# Altium schematic sheet M1.SchDoc
size A3; DocumentNumber: 2; SheetNumber: 2; SheetTotal: 8
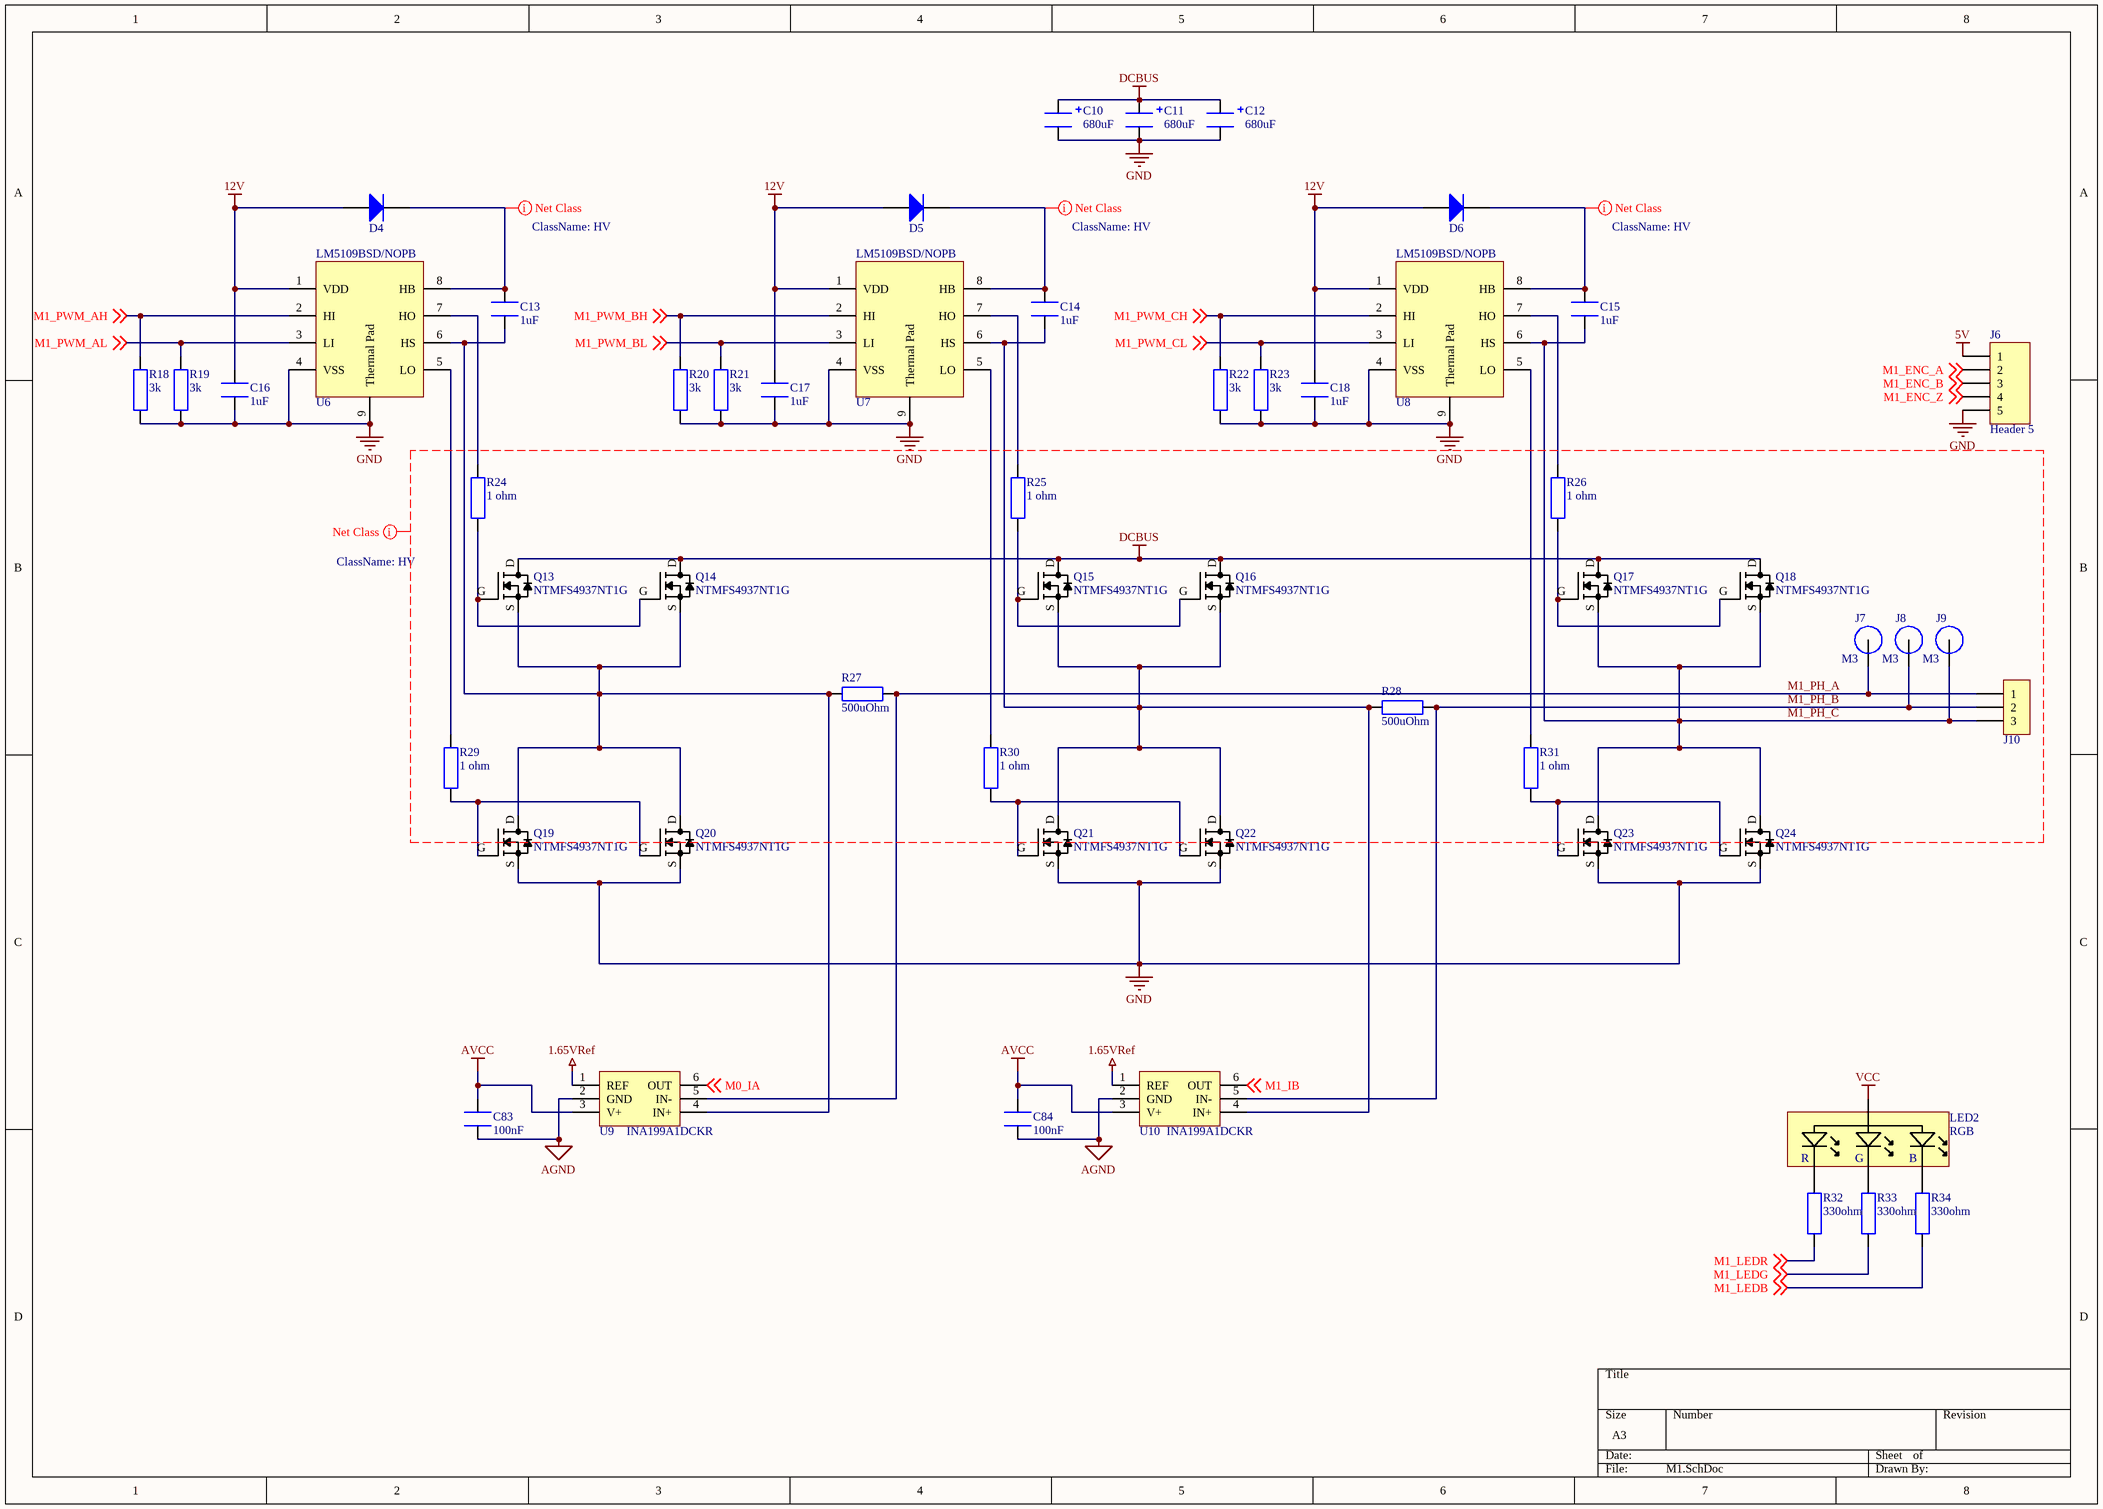
[diagram p0: M1.SchDoc]

## Parts
C10  value 680uF  [CAPE10.0MM_Rad_10x14mm]  (hidden comment: 35ZLH680MEFC10X23)
C11  value 680uF  [CAPE10.0MM_Rad_10x14mm]  (hidden comment: 35ZLH680MEFC10X23)
C12  value 680uF  [CAPE10.0MM_Rad_10x14mm]  (hidden comment: 35ZLH680MEFC10X23)
C13  value 1uF  [1608[0603]]  (hidden comment: MC0603X105K160)
C14  value 1uF  [1608[0603]]  (hidden comment: MC0603X105K160)
C15  value 1uF  [1608[0603]]  (hidden comment: MC0603X105K160)
C16  value 1uF  [1608[0603]]  (hidden comment: MC0603X105K160)
C17  value 1uF  [1608[0603]]  (hidden comment: MC0603X105K160)
C18  value 1uF  [1608[0603]]  (hidden comment: MC0603X105K160)
C83  value 100nF  [1608[0603]]  (hidden comment: MC0603B104K160CT)
C84  value 100nF  [1608[0603]]  (hidden comment: MC0603B104K160CT)
D4  RB521S30T1G  [SOD523F]  (value not drawn)
D5  RB521S30T1G  [SOD523F]  (value not drawn)
D6  RB521S30T1G  [SOD523F]  (value not drawn)
J6  Header 5  [HDR1X5]
J7  M3  [M3 Spade Hole]
J8  M3  [M3 Spade Hole]
J9  M3  [M3 Spade Hole]
J10  MC000051  [MC000051]  (value not drawn)
LED2  RGB  [ASMB-MTB1]
Q13  NTMFS4937NT1G  [SO8FL]
Q14  NTMFS4937NT1G  [SO8FL]
Q15  NTMFS4937NT1G  [SO8FL]
Q16  NTMFS4937NT1G  [SO8FL]
Q17  NTMFS4937NT1G  [SO8FL]
Q18  NTMFS4937NT1G  [SO8FL]
Q19  NTMFS4937NT1G  [SO8FL]
Q20  NTMFS4937NT1G  [SO8FL]
Q21  NTMFS4937NT1G  [SO8FL]
Q22  NTMFS4937NT1G  [SO8FL]
Q23  NTMFS4937NT1G  [SO8FL]
Q24  NTMFS4937NT1G  [SO8FL]
R18  value 3k  [RESC1608X55N]  (hidden comment: MCMR06X3001FTL)
R19  value 3k  [RESC1608X55N]  (hidden comment: MCMR06X3001FTL)
R20  value 3k  [RESC1608X55N]  (hidden comment: MCMR06X3001FTL)
R21  value 3k  [RESC1608X55N]  (hidden comment: MCMR06X3001FTL)
R22  value 3k  [RESC1608X55N]  (hidden comment: MCMR06X3001FTL)
R23  value 3k  [RESC1608X55N]  (hidden comment: MCMR06X3001FTL)
R24  value 1 ohm  [RESC1608X55N]  (hidden comment: MCWR06W1R00FTL)
R25  value 1 ohm  [RESC1608X55N]  (hidden comment: MCWR06W1R00FTL)
R26  value 1 ohm  [RESC1608X55N]  (hidden comment: MCWR06W1R00FTL)
R27  value 500uOhm  [RESC6332X70N]  (hidden comment: TLR3A20DR0005FTDG)
R28  value 500uOhm  [RESC6332X70N]  (hidden comment: TLR3A20DR0005FTDG)
R29  value 1 ohm  [RESC1608X55N]  (hidden comment: MCWR06W1R00FTL)
R30  value 1 ohm  [RESC1608X55N]  (hidden comment: MCWR06W1R00FTL)
R31  value 1 ohm  [RESC1608X55N]  (hidden comment: MCWR06W1R00FTL)
R32  value 330ohm  [RESC1608X55N]  (hidden comment: MCWR06X3300FTL)
R33  value 330ohm  [RESC1608X55N]  (hidden comment: MCWR06X3300FTL)
R34  value 330ohm  [RESC1608X55N]  (hidden comment: MCWR06X3300FTL)
U6  LM5109BSD/NOPB  [SON80P400X80_HS-9N]
U7  LM5109BSD/NOPB  [SON80P400X80_HS-9N]
U8  LM5109BSD/NOPB  [SON80P400X80_HS-9N]
U9  INA199A1DCKR  [TSOP65P210X110-6N]
U10  INA199A1DCKR  [TSOP65P210X110-6N]

## Nets
1.65VRef: U9.1(REF) U10.1(REF)
5V: J6.1
12V: C16.2 C17.2 C18.2 D4.A D5.A D6.A U6.1(VDD) U7.1(VDD) U8.1(VDD)
AGND: C83.1 C84.1 U9.2(GND) U10.2(GND)
AVCC: C83.2 C84.2 U9.3(V+) U10.3(V+)
DCBUS: C10.1 C11.1 C12.1 Q13.D Q14.D Q15.D Q16.D Q17.D Q18.D
GND: C10.2 C11.2 C12.2 C16.1 C17.1 C18.1 J6.5 Q19.S Q20.S Q21.S Q22.S Q23.S Q24.S R18.1 R19.1 R20.1 R21.1 R22.1 R23.1 U6.4(VSS) U6.9(Thermal_Pad) U7.4(VSS) U7.9(Thermal_Pad) U8.4(VSS) U8.9(Thermal_Pad)
VCC: LED2.4(A)
M0_IA: U9.6(OUT) ; off-sheet M0_IA
M1_ENC_A: J6.2 ; off-sheet M1_ENC_A
M1_ENC_B: J6.3 ; off-sheet M1_ENC_B
M1_ENC_Z: J6.4 ; off-sheet M1_ENC_Z
M1_IB: U10.6(OUT) ; off-sheet M1_IB
M1_LEDB: R34.2 ; off-sheet M1_LEDB
M1_LEDG: R33.2 ; off-sheet M1_LEDG
M1_LEDR: R32.2 ; off-sheet M1_LEDR
M1_PH_A: J7.1 J10.1 R27.1 U9.5(IN-)
M1_PH_B: J8.1 J10.2 R28.1 U10.5(IN-)
M1_PH_C: C15.1 J9.1 J10.3 Q17.S Q18.S Q23.D Q24.D U8.6(HS)
M1_PWM_AH: R18.2 U6.2(HI) ; off-sheet M1_PWM_AH
M1_PWM_AL: R19.2 U6.3(LI) ; off-sheet M1_PWM_AL
M1_PWM_BH: R20.2 U7.2(HI) ; off-sheet M1_PWM_BH
M1_PWM_BL: R21.2 U7.3(LI) ; off-sheet M1_PWM_BL
M1_PWM_CH: R22.2 U8.2(HI) ; off-sheet M1_PWM_CH
M1_PWM_CL: R23.2 U8.3(LI) ; off-sheet M1_PWM_CL
NetC13_1: C13.1 Q13.S Q14.S Q19.D Q20.D R27.2 U6.6(HS) U9.4(IN+)
NetC13_2: C13.2 D4.K U6.8(HB)
NetC14_1: C14.1 Q15.S Q16.S Q21.D Q22.D R28.2 U7.6(HS) U10.4(IN+)
NetC14_2: C14.2 D5.K U7.8(HB)
NetC15_2: C15.2 D6.K U8.8(HB)
NetLED2_1: LED2.1(R) R32.1
NetLED2_2: LED2.2(G) R33.1
NetLED2_3: LED2.3(B) R34.1
NetQ13_G: Q13.G Q14.G R24.1
NetQ15_G: Q15.G Q16.G R25.1
NetQ17_G: Q17.G Q18.G R26.1
NetQ19_G: Q19.G Q20.G R29.1
NetQ21_G: Q21.G Q22.G R30.1
NetQ23_G: Q23.G Q24.G R31.1
NetR24_2: R24.2 U6.7(HO)
NetR25_2: R25.2 U7.7(HO)
NetR26_2: R26.2 U8.7(HO)
NetR29_2: R29.2 U6.5(LO)
NetR30_2: R30.2 U7.5(LO)
NetR31_2: R31.2 U8.5(LO)

## Layout directives
net class HV: DCBUS, M1_PH_A, M1_PH_B, M1_PH_C, NetC13_2, NetC14_2, NetC15_2

## Library data of the parts
C10-C12 = 35ZLH680MEFC10X23: CAP, ALU ELEC, 680UF, 35V, RAD; Supplier 1: Farnell; Supplier Part Number 1: 8126771
C13-C18 = MC0603X105K160: CAP, MLCC, X5R, 1UF, 16V, 0603; Supplier 1: Farnell; Supplier Part Number 1: 2310630; Supplier 2: Farnell; Supplier Part Number 2: 1759407RL; Supplier 3: Farnell; Supplier Part Number 3: 1759407
C83 C84 = MC0603B104K160CT: CAP, MLCC, X7R, 100NF, 16V, 0603; Supplier 1: Farnell; Supplier Part Number 1: 2310628; Supplier 2: Farnell; Supplier Part Number 2: 1759016RL; Supplier 3: Farnell; Supplier Part Number 3: 1759016
D4-D6 = RB521S30T1G: DIODE, SCHOTTKY, 200MA, 30V; Supplier 1: Farnell; Supplier Part Number 1: 2317433
J6 = Header 5: Header, 5-Pin; LatestRevisionDate: 17-Jul-2002; LatestRevisionNote: Re-released for DXP Platform.; Publisher: Altium Limited
J7-J9 = M3 Spade Terminal
J10 = MC000051: TERMINAL BLOCK, WIRE TO BRD, 3POS, 10AWG; Supplier 1: Farnell; Supplier Part Number 1: 2008022
LED2 = ASMB-MTB1-0A3A2: LED, HB, RGB, 0.09W, PLCC-4; Supplier 1: Farnell; Supplier Part Number 1: 2401106
Q13-Q24 = NTMFS4937NT1G: MOSFET, N CH, 30V, 70A, SO-8 FL; Supplier 1: Farnell; Supplier Part Number 1: 2317605; Supplier 2: Farnell; Supplier Part Number 2: 2317605RL
R18-R23 = MCMR06X3001FTL: RESISTOR, 0603, 3K, 1%, ANTI SULFUR; Supplier 1: Farnell; Supplier Part Number 1: 2073461; Supplier 2: Farnell; Supplier Part Number 2: 2073461RL
R24-R26 R29-R31 = MCWR06W1R00FTL: RES, THICK FILM, 1OHM, 1%, 0.1W; Supplier 1: Farnell; Supplier 2: Farnell; Supplier Part Number 1: 2447289; Supplier Part Number 2: 2447289RL
R27 R28 = TLR3A20DR0005FTDG: RESISTOR, R0005, 2.0W, 1%
R32-R34 = MCWR06X3300FTL: RES, THICK FILM, 330 OHM, 1%, 0.1W; Supplier 1: Farnell; Supplier Part Number 1: 2447339RL; Supplier 2: Farnell; Supplier Part Number 2: 2446656; Supplier 3: Farnell; Supplier Part Number 3: 2447339
U6-U8 = LM5109BSD/NOPB: DRIVER, MOSFET, HALF BRIDGE, WSON-8, 1A; Supplier 1: Farnell; Supplier Part Number 1: 2400642RL; Supplier 2: Farnell; Supplier Part Number 2: 2400642; Supplier 3: Farnell; Supplier Part Number 3: 2382850
U9 U10 = INA199A1DCKR: CURRENT SENSE AMP, 50V/V, 80KHZ; Supplier 1: Digi-Key; Supplier Part Number 1: 296-27329-1-ND; Supplier 2: Mouser; Supplier Part Number 2: 595-INA199B1DCKT